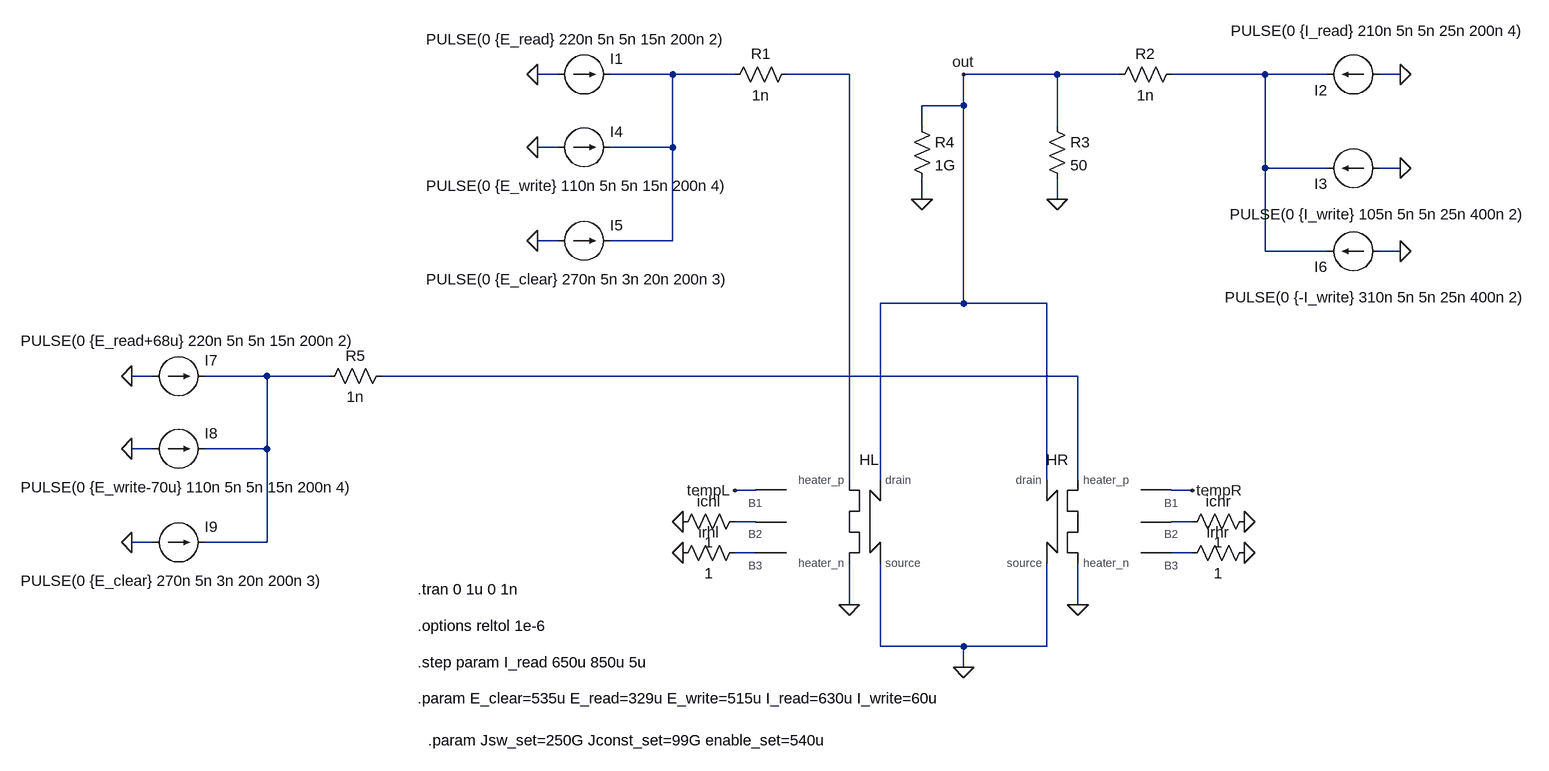
[diagram p0: schematic nmem_cell_read.asc]
nmem_cell_read.asc, the LTspice schematic file:
Version 4.1
SHEET 1 2708 1228
WIRE -400 32 -432 32
WIRE -224 32 -320 32
WIRE -128 32 -224 32
WIRE 48 32 -48 32
WIRE 368 32 224 32
WIRE 464 32 368 32
WIRE 688 32 544 32
WIRE 784 32 688 32
WIRE 896 32 864 32
WIRE 224 80 224 32
WIRE 224 80 160 80
WIRE 160 112 160 80
WIRE 368 112 368 32
WIRE -400 144 -432 144
WIRE -224 144 -224 32
WIRE -224 144 -320 144
WIRE 688 176 688 32
WIRE 784 176 688 176
WIRE 896 176 864 176
WIRE 160 224 160 192
WIRE 368 224 368 192
WIRE -400 288 -432 288
WIRE -224 288 -224 144
WIRE -224 288 -320 288
WIRE 688 304 688 176
WIRE 784 304 688 304
WIRE 896 304 864 304
WIRE 224 384 224 80
WIRE 224 384 96 384
WIRE 352 384 224 384
WIRE -1024 496 -1056 496
WIRE -848 496 -944 496
WIRE -752 496 -848 496
WIRE 400 496 -672 496
WIRE -1024 608 -1056 608
WIRE -848 608 -848 496
WIRE -848 608 -944 608
WIRE 48 656 48 32
WIRE 96 656 96 384
WIRE 352 656 352 384
WIRE 400 656 400 496
WIRE -96 672 -128 672
WIRE 576 672 544 672
WIRE -96 720 -128 720
WIRE 576 720 544 720
WIRE -1024 752 -1056 752
WIRE -848 752 -848 608
WIRE -848 752 -944 752
WIRE -96 768 -128 768
WIRE 576 768 544 768
WIRE 48 848 48 784
WIRE 400 848 400 784
WIRE 96 912 96 784
WIRE 224 912 96 912
WIRE 352 912 352 784
WIRE 352 912 224 912
WIRE 224 944 224 912
FLAG -432 32 0
FLAG 896 176 0
FLAG 224 32 out
FLAG 224 944 0
FLAG 400 848 0
FLAG 896 32 0
FLAG -432 144 0
FLAG 368 224 0
FLAG -128 672 tempL
FLAG -432 288 0
FLAG 896 304 0
FLAG 160 224 0
FLAG 576 672 tempR
FLAG -208 720 0
FLAG -208 768 0
FLAG 656 768 0
FLAG 656 720 0
FLAG -1056 496 0
FLAG -1056 608 0
FLAG -1056 752 0
FLAG 48 848 0
SYMBOL current -400 32 R270
WINDOW 0 24 80 VRight 2
WINDOW 3 54 -203 VRight 2
WINDOW 123 0 0 Left 0
WINDOW 39 0 0 Left 0
SYMATTR InstName I1
SYMATTR Value PULSE(0 {E_read} 220n 5n 5n 15n 200n 2)
SYMBOL current 864 32 R90
WINDOW 0 24 80 VRight 2
WINDOW 3 -67 -228 VRight 2
WINDOW 123 0 0 Left 0
WINDOW 39 0 0 Left 0
SYMATTR InstName I2
SYMATTR Value PULSE(0 {I_read} 210n 5n 5n 25n 200n 4)
SYMBOL current 864 176 R90
WINDOW 0 24 80 VRight 2
WINDOW 3 71 -229 VRight 2
WINDOW 123 0 0 Left 0
WINDOW 39 0 0 Left 0
SYMATTR InstName I3
SYMATTR Value PULSE(0 {I_write} 105n 5n 5n 25n 400n 2)
SYMBOL current -400 144 R270
WINDOW 0 24 80 VRight 2
WINDOW 3 -59 -203 VRight 2
WINDOW 123 0 0 Left 0
WINDOW 39 0 0 Left 0
SYMATTR InstName I4
SYMATTR Value PULSE(0 {E_write} 110n 5n 5n 15n 200n 4)
SYMBOL res -144 48 R270
WINDOW 0 32 56 VTop 2
WINDOW 3 0 56 VBottom 2
SYMATTR InstName R1
SYMATTR Value 1n
SYMBOL res 560 16 R90
WINDOW 0 0 56 VBottom 2
WINDOW 3 32 56 VTop 2
SYMATTR InstName R2
SYMATTR Value 1n
SYMBOL res 352 96 R0
SYMATTR InstName R3
SYMATTR Value 50
SYMBOL current -400 288 R270
WINDOW 0 24 80 VRight 2
WINDOW 3 -59 -203 VRight 2
WINDOW 123 0 0 Left 0
WINDOW 39 0 0 Left 0
SYMATTR InstName I5
SYMATTR Value PULSE(0 {E_clear} 270n 5n 3n 20n 200n 3)
SYMBOL current 864 304 R90
WINDOW 0 24 80 VRight 2
WINDOW 3 71 -229 VRight 2
WINDOW 123 0 0 Left 0
WINDOW 39 0 0 Left 0
SYMATTR InstName I6
SYMATTR Value PULSE(0 {-I_write} 310n 5n 5n 25n 400n 2)
SYMBOL res 144 96 R0
SYMATTR InstName R4
SYMATTR Value 1G
SYMBOL hTron_behavioral 112 720 R0
SYMATTR InstName HL
SYMATTR SpiceLine chan_width=250n, heater_width=100n, chan_thickness=23.6n, chan_length=2.2u, sheet_resistance=78, heater_resistance=300, critical_temp=12.5, substrate_temp=1.3, eta=3, Jsw_tilde={Jsw_set}, Isupp_tilde={enable_set}, Jchanr={Jconst_set}, tau_on=5n, ICh_bias_on=100u, Ih_bias_on=500u
SYMBOL hTron_behavioral 336 720 M0
SYMATTR InstName HR
SYMATTR SpiceLine chan_width=350n, heater_width=100n, chan_thickness=23.6n, chan_length=4.0u, sheet_resistance=78, heater_resistance=300, critical_temp=12.5, substrate_temp=1.3, eta=3, Jsw_tilde={Jsw_set}, Isupp_tilde={enable_set}, Jchanr={Jconst_set}, tau_on=5n, ICh_bias_on=100u, Ih_bias_on=500u
SYMBOL res 560 784 R270
WINDOW 0 32 56 VTop 2
WINDOW 3 0 56 VBottom 2
SYMATTR InstName irhr
SYMATTR Value 1
SYMBOL res 560 736 R270
WINDOW 0 32 56 VTop 2
WINDOW 3 0 56 VBottom 2
SYMATTR InstName ichr
SYMATTR Value 1
SYMBOL res -112 752 R90
WINDOW 0 0 56 VBottom 2
WINDOW 3 32 56 VTop 2
SYMATTR InstName irhl
SYMATTR Value 1
SYMBOL res -112 704 R90
WINDOW 0 0 56 VBottom 2
WINDOW 3 32 56 VTop 2
SYMATTR InstName ichl
SYMATTR Value 1
SYMBOL current -1024 496 R270
WINDOW 0 24 80 VRight 2
WINDOW 3 54 -203 VRight 2
WINDOW 123 0 0 Left 0
WINDOW 39 0 0 Left 0
SYMATTR InstName I7
SYMATTR Value PULSE(0 {E_read+68u} 220n 5n 5n 15n 200n 2)
SYMBOL current -1024 608 R270
WINDOW 0 24 80 VRight 2
WINDOW 3 -59 -203 VRight 2
WINDOW 123 0 0 Left 0
WINDOW 39 0 0 Left 0
SYMATTR InstName I8
SYMATTR Value PULSE(0 {E_write-70u} 110n 5n 5n 15n 200n 4)
SYMBOL res -768 512 R270
WINDOW 0 32 56 VTop 2
WINDOW 3 0 56 VBottom 2
SYMATTR InstName R5
SYMATTR Value 1n
SYMBOL current -1024 752 R270
WINDOW 0 24 80 VRight 2
WINDOW 3 -59 -203 VRight 2
WINDOW 123 0 0 Left 0
WINDOW 39 0 0 Left 0
SYMATTR InstName I9
SYMATTR Value PULSE(0 {E_clear} 270n 5n 3n 20n 200n 3)
TEXT -616 992 Left 2 !.param E_clear=535u E_read=329u E_write=515u I_read=630u I_write=60u
TEXT -616 824 Left 2 !.tran 0 1u 0 1n
TEXT -616 880 Left 2 !.options reltol 1e-6
TEXT -616 936 Left 2 !.step param I_read 650u 850u 5u
TEXT -600 1056 Left 2 !.param Jsw_set=250G Jconst_set=99G enable_set=540u

The netlist it stands for:
* nmem_cell_read.asc
I1 0 N001 PULSE(0 {E_read} 220n 5n 5n 15n 200n 2)
I2 0 N003 PULSE(0 {I_read} 210n 5n 5n 25n 200n 4)
I3 0 N003 PULSE(0 {I_write} 105n 5n 5n 25n 400n 2)
I4 0 N001 PULSE(0 {E_write} 110n 5n 5n 15n 200n 4)
R1 N001 N002 1n
R2 N003 out 1n
R3 out 0 50
I5 0 N001 PULSE(0 {E_clear} 270n 5n 3n 20n 200n 3)
I6 0 N003 PULSE(0 {-I_write} 310n 5n 5n 25n 400n 2)
R4 out 0 1G
X§HL N002 0 out 0 tempL N006 N008 hTron_behav chan_width=250n, heater_width=100n, chan_thickness=23.6n, chan_length=2.2u, sheet_resistance=78, heater_resistance=300, critical_temp=12.5, substrate_temp=1.3, eta=3, Jsw_tilde={Jsw_set}, Isupp_tilde={enable_set}, Jchanr={Jconst_set}, tau_on=5n, ICh_bias_on=100u, Ih_bias_on=500u  ; pins heater_p heater_n drain source B1 B2 B3
X§HR N005 0 out 0 tempR N007 N009 hTron_behav chan_width=350n, heater_width=100n, chan_thickness=23.6n, chan_length=4.0u, sheet_resistance=78, heater_resistance=300, critical_temp=12.5, substrate_temp=1.3, eta=3, Jsw_tilde={Jsw_set}, Isupp_tilde={enable_set}, Jchanr={Jconst_set}, tau_on=5n, ICh_bias_on=100u, Ih_bias_on=500u  ; pins heater_p heater_n drain source B1 B2 B3
R§irhr N009 0 1
R§ichr N007 0 1
R§irhl N008 0 1
R§ichl N006 0 1
I7 0 N004 PULSE(0 {E_read+68u} 220n 5n 5n 15n 200n 2)
I8 0 N004 PULSE(0 {E_write-70u} 110n 5n 5n 15n 200n 4)
R5 N004 N005 1n
I9 0 N004 PULSE(0 {E_clear} 270n 5n 3n 20n 200n 3)
.param E_clear=535u E_read=329u E_write=515u I_read=630u I_write=60u
.tran 0 1u 0 1n
.options reltol 1e-6
.step param I_read 650u 850u 5u
.param Jsw_set=250G Jconst_set=99G enable_set=540u
.lib hTron_behavioral.lib
.backanno
.end